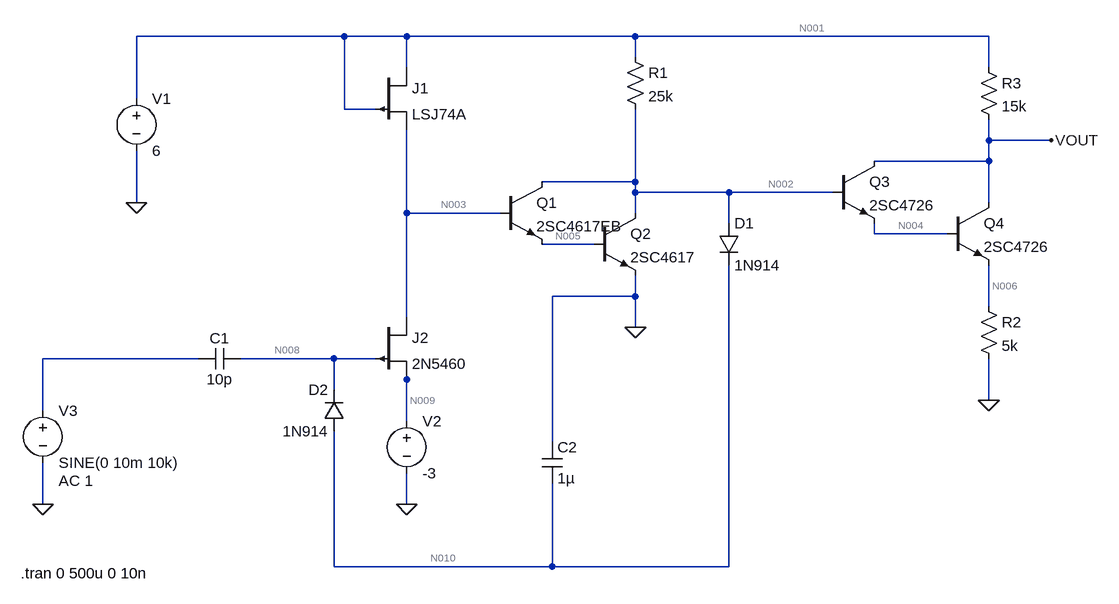
[diagram p0: schematic low_noise_amp.asc]
low_noise_amp.asc, the LTspice schematic file:
Version 4
SHEET 1 1176 812
WIRE 0 -32 -320 -32
WIRE 96 -32 0 -32
WIRE 448 -32 96 -32
WIRE 992 -32 448 -32
WIRE 448 0 448 -32
WIRE 96 16 96 -32
WIRE 992 16 992 -32
WIRE -320 64 -320 -32
WIRE 0 80 0 -32
WIRE 48 80 0 80
WIRE 992 128 992 96
WIRE 1088 128 992 128
WIRE 992 160 992 128
WIRE 992 160 816 160
WIRE 448 192 448 80
WIRE 448 192 304 192
WIRE 448 208 448 192
WIRE 592 208 448 208
WIRE 752 208 592 208
WIRE -320 224 -320 144
WIRE 992 224 992 160
WIRE 96 240 96 112
WIRE 240 240 96 240
WIRE 448 240 448 208
WIRE 592 256 592 208
WIRE 816 272 816 256
WIRE 928 272 816 272
WIRE 384 288 304 288
WIRE 448 368 448 336
WIRE 448 368 320 368
WIRE 992 384 992 320
WIRE 96 400 96 240
WIRE 448 416 448 368
WIRE -224 464 -464 464
WIRE -16 464 -160 464
WIRE 48 464 -16 464
WIRE 96 496 96 480
WIRE -16 512 -16 464
WIRE 992 528 992 464
WIRE -464 544 -464 464
WIRE 96 560 96 496
WIRE 320 592 320 368
WIRE -464 688 -464 624
WIRE 96 688 96 640
WIRE -16 784 -16 576
WIRE 320 784 320 656
WIRE 320 784 -16 784
WIRE 592 784 592 320
WIRE 592 784 320 784
FLAG -320 224 0
FLAG 96 688 0
FLAG -464 688 0
FLAG 448 416 0
FLAG 992 528 0
FLAG 1088 128 VOUT
DATAFLAG 176 240 ""
DATAFLAG 512 208 ""
DATAFLAG -96 464 ""
DATAFLAG 352 288 ""
DATAFLAG 992 128 ""
SYMBOL pjf 48 16 R0
SYMATTR InstName J1
SYMATTR Value LSJ74A
SYMBOL pjf 48 400 R0
SYMATTR InstName J2
SYMATTR Value 2N5460
SYMBOL voltage -320 48 R0
WINDOW 123 0 0 Left 0
WINDOW 39 0 0 Left 0
SYMATTR InstName V1
SYMATTR Value 6
SYMBOL voltage 96 544 R0
WINDOW 123 0 0 Left 0
WINDOW 39 0 0 Left 0
SYMATTR InstName V2
SYMATTR Value -3
SYMBOL cap -160 448 R90
WINDOW 0 0 32 VBottom 2
WINDOW 3 32 32 VTop 2
SYMATTR InstName C1
SYMATTR Value 10p
SYMBOL voltage -464 528 R0
WINDOW 123 24 124 Left 2
WINDOW 39 0 0 Left 0
SYMATTR InstName V3
SYMATTR Value SINE(0 10m 10k)
SYMATTR Value2 AC 1
SYMBOL npn 240 192 R0
SYMATTR InstName Q1
SYMATTR Value 2SC4617EB
SYMBOL res 432 -16 R0
SYMATTR InstName R1
SYMATTR Value 25k
SYMBOL npn 384 240 R0
SYMATTR InstName Q2
SYMATTR Value 2SC4617
SYMBOL diode 576 256 R0
SYMATTR InstName D1
SYMATTR Value 1N914
SYMBOL diode 0 576 R180
WINDOW 0 24 64 Left 2
WINDOW 3 24 0 Left 2
SYMATTR InstName D2
SYMATTR Value 1N914
SYMBOL cap 304 592 R0
SYMATTR InstName C2
SYMATTR Value 1µ
SYMBOL npn 752 160 R0
SYMATTR InstName Q3
SYMATTR Value 2SC4726
SYMBOL npn 928 224 R0
SYMATTR InstName Q4
SYMATTR Value 2SC4726
SYMBOL res 976 368 R0
SYMATTR InstName R2
SYMATTR Value 5k
SYMBOL res 976 0 R0
SYMATTR InstName R3
SYMATTR Value 15k
TEXT -498 794 Left 2 !.tran 0 500u 0 10n

The netlist it stands for:
* low_noise_amp.asc
J1 N001 N001 N003 LSJ74A
J2 N003 N008 N009 2N5460
V1 N001 0 6
V2 N009 0 -3
C1 N008 N007 10p
V3 N007 0 SINE(0 10m 10k) AC 1
Q1 N002 N003 N005 0 2SC4617EB
R1 N001 N002 25k
Q2 N002 N005 0 0 2SC4617
D1 N002 N010 1N914
D2 N010 N008 1N914
C2 0 N010 1µ
Q3 VOUT N002 N004 0 2SC4726
Q4 VOUT N004 N006 0 2SC4726
R2 N006 0 5k
R3 N001 VOUT 15k
.model D D
.lib standard.dio
.model NPN NPN
.model PNP PNP
.lib standard.bjt
.model NJF NJF
.model PJF PJF
.lib standard.jft
.tran 0 500u 0 10n
.backanno
.end

* Results of the author's LTspice run, read from the files saved beside the schematic
* Operating Point, zero values left out:
*   V(n001) = 6 V
*   V(n003) = 965.7 mV
*   V(n008) = 2.221 V
*   V(n009) = -3 V
*   V(n002) = 2.221 V
*   V(n005) = 555.6 mV
*   V(n010) = 2.221 V
*   V(vout) = 3.02 V
*   V(n004) = 1.666 V
*   V(n006) = 993.5 mV
*   Ic(Q4) = 196.6 µA
*   Ib(Q4) = 2.113 µA
*   Ie(Q4) = -198.7 µA
*   Ic(Q3) = 2.089 µA
*   Ib(Q3) = 24.98 nA
*   Ie(Q3) = -2.114 µA
*   Ic(Q2) = 150.6 µA
*   Ib(Q2) = 544.7 nA
*   Ie(Q2) = -151.1 µA
*   Ic(Q1) = 542.4 nA
*   Ib(Q1) = 2.246 nA
*   Ie(Q1) = -544.7 nA
*   I(D2) = 9.475 pA
*   I(D1) = 9.475 pA
*   Id(J2) = 4.578 mA
*   Ig(J2) = 9.476 pA
*   Is(J2) = -4.578 mA
*   Id(J1) = 4.578 mA
*   Ig(J1) = 27.7 pA
*   Is(J1) = -4.578 mA
*   I(R3) = 198.7 µA
*   I(R2) = 198.7 µA
*   I(R1) = 151.2 µA
*   I(V2) = 4.578 mA
*   I(V1) = -4.928 mA
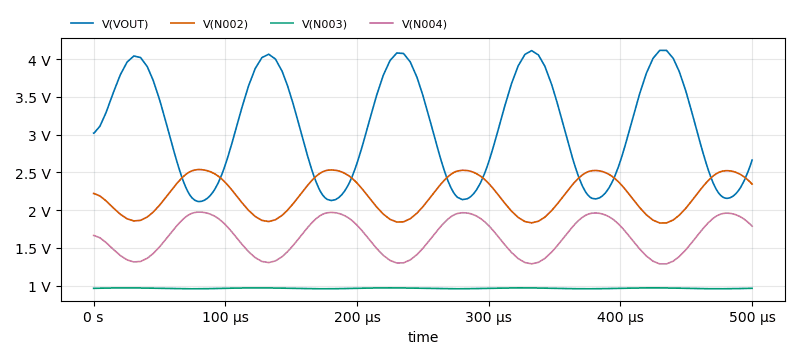
[diagram p1: Transient Analysis of low_noise_amp.asc, plotted from the saved traces]
* Transient Analysis, 1 run:
*   V(VOUT): min 2.114 V, max 4.115 V, average 3.087 V, rms 3.165 V, last 2.662 V
*   V(N002): min 1.831 V, max 2.538 V, average 2.196 V, rms 2.21 V, last 2.345 V
*   V(N003): min 959.4 mV, max 972.1 mV, average 965.7 mV, rms 965.7 mV, last 966.3 mV
*   V(N004): min 1.288 V, max 1.975 V, average 1.642 V, rms 1.66 V, last 1.788 V